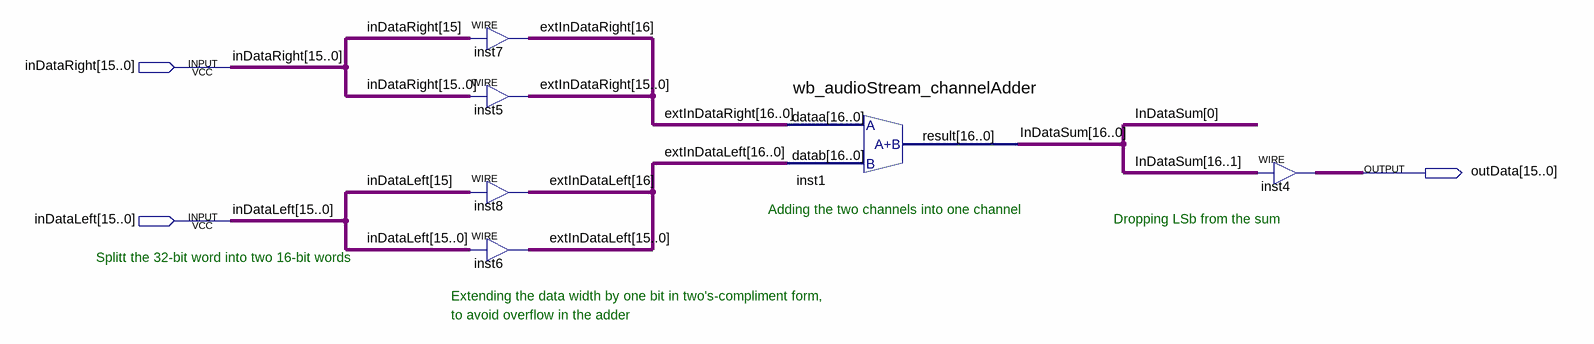
[diagram p0: schematic sheet]
// Quartus schematic wb_audioStream_stereoToMono.bdf as structural Verilog: 6 symbols, 3 pins
module wb_audioStream_stereoToMono (
  input  [15:0] inDataRight,
  input  [15:0] inDataLeft,
  output [15:0] outData
);

  wire [16:0] extInDataLeft, extInDataRight, InDataSum;

  assign extInDataRight[16] = inDataRight[15];  // WIRE inst7
  assign extInDataRight[15:0] = inDataRight;  // WIRE inst5
  assign extInDataLeft[16] = inDataLeft[15];  // WIRE inst8
  assign extInDataLeft[15:0] = inDataLeft;  // WIRE inst6
  wb_audioStream_channelAdder inst1 (.dataa(extInDataRight), .datab(extInDataLeft), .result(InDataSum));
  assign outData = InDataSum[16:1];  // WIRE inst4

  // Notes on the sheet:
  //   Adding the two channels into one channel
  //   Dropping LSb from the sum
  //   Splitt the 32-bit word into two 16-bit words
  //   Extending the data width by one bit in two's-compliment form,
  //   to avoid overflow in the adder
endmodule
